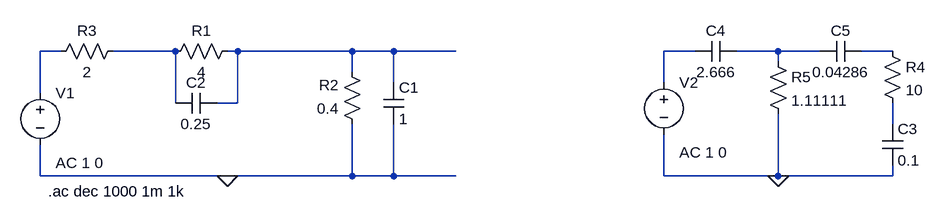
[diagram p0: schematic PuntoB.asc]
PuntoB.asc, the LTspice schematic file:
Version 4
SHEET 1 1240 680
WIRE -96 48 -128 48
WIRE 80 48 -16 48
WIRE 176 48 160 48
WIRE 352 48 176 48
WIRE 416 48 352 48
WIRE 512 48 416 48
WIRE 880 48 832 48
WIRE 1008 48 944 48
WIRE 1072 48 1008 48
WIRE 1184 48 1136 48
WIRE 1008 64 1008 48
WIRE 352 80 352 48
WIRE 416 96 416 48
WIRE 832 96 832 48
WIRE -128 112 -128 48
WIRE 80 128 80 48
WIRE 176 128 176 48
WIRE 176 128 144 128
WIRE 1184 160 1184 128
WIRE -128 240 -128 192
WIRE 160 240 -128 240
WIRE 352 240 352 160
WIRE 352 240 160 240
WIRE 416 240 416 160
WIRE 416 240 352 240
WIRE 512 240 416 240
WIRE 832 240 832 176
WIRE 1008 240 1008 144
WIRE 1008 240 832 240
WIRE 1184 240 1184 224
WIRE 1184 240 1008 240
FLAG 160 240 0
FLAG 1008 240 0
SYMBOL res 176 32 R90
WINDOW 0 0 56 VBottom 2
WINDOW 3 32 56 VTop 2
SYMATTR InstName R1
SYMATTR Value 4
SYMBOL res 368 176 R180
WINDOW 0 36 76 Left 2
WINDOW 3 36 40 Left 2
SYMATTR InstName R2
SYMATTR Value 0.4
SYMBOL cap 400 96 R0
SYMATTR InstName C1
SYMATTR Value 1
SYMBOL cap 144 112 R90
WINDOW 0 0 32 VBottom 2
WINDOW 3 32 32 VTop 2
SYMATTR InstName C2
SYMATTR Value 0.25
SYMBOL res 0 32 R90
WINDOW 0 0 56 VBottom 2
WINDOW 3 32 56 VTop 2
SYMATTR InstName R3
SYMATTR Value 2
SYMBOL voltage -128 96 R0
WINDOW 123 24 124 Left 2
WINDOW 39 0 0 Left 0
SYMATTR InstName V1
SYMATTR Value ""
SYMATTR Value2 AC 1 0
SYMBOL res 1168 32 R0
SYMATTR InstName R4
SYMATTR Value 10
SYMBOL cap 1168 160 R0
SYMATTR InstName C3
SYMATTR Value 0.1
SYMBOL cap 944 32 R90
WINDOW 0 0 32 VBottom 2
WINDOW 3 32 32 VTop 2
SYMATTR InstName C4
SYMATTR Value 2.666
SYMBOL res 992 48 R0
SYMATTR InstName R5
SYMATTR Value 1.11111
SYMBOL voltage 832 80 R0
WINDOW 123 24 124 Left 2
WINDOW 39 0 0 Left 0
SYMATTR InstName V2
SYMATTR Value ""
SYMATTR Value2 AC 1 0
SYMBOL cap 1136 32 R90
WINDOW 0 0 32 VBottom 2
WINDOW 3 32 32 VTop 2
SYMATTR InstName C5
SYMATTR Value 0.04286
TEXT -116 264 Left 2 !.ac dec 1000 1m 1k

The netlist it stands for:
* PuntoB.asc
R1 N003 N002 4
R2 0 N003 0.4
C1 N003 0 1
C2 N003 N002 0.25
R3 N002 N001 2
V1 N001 0 AC 1 0
R4 N006 N007 10
C3 N007 0 0.1
C4 N005 N004 2.666
R5 N005 0 1.11111
V2 N004 0 AC 1 0
C5 N006 N005 0.04286
.ac dec 1000 1m 1k
.backanno
.end